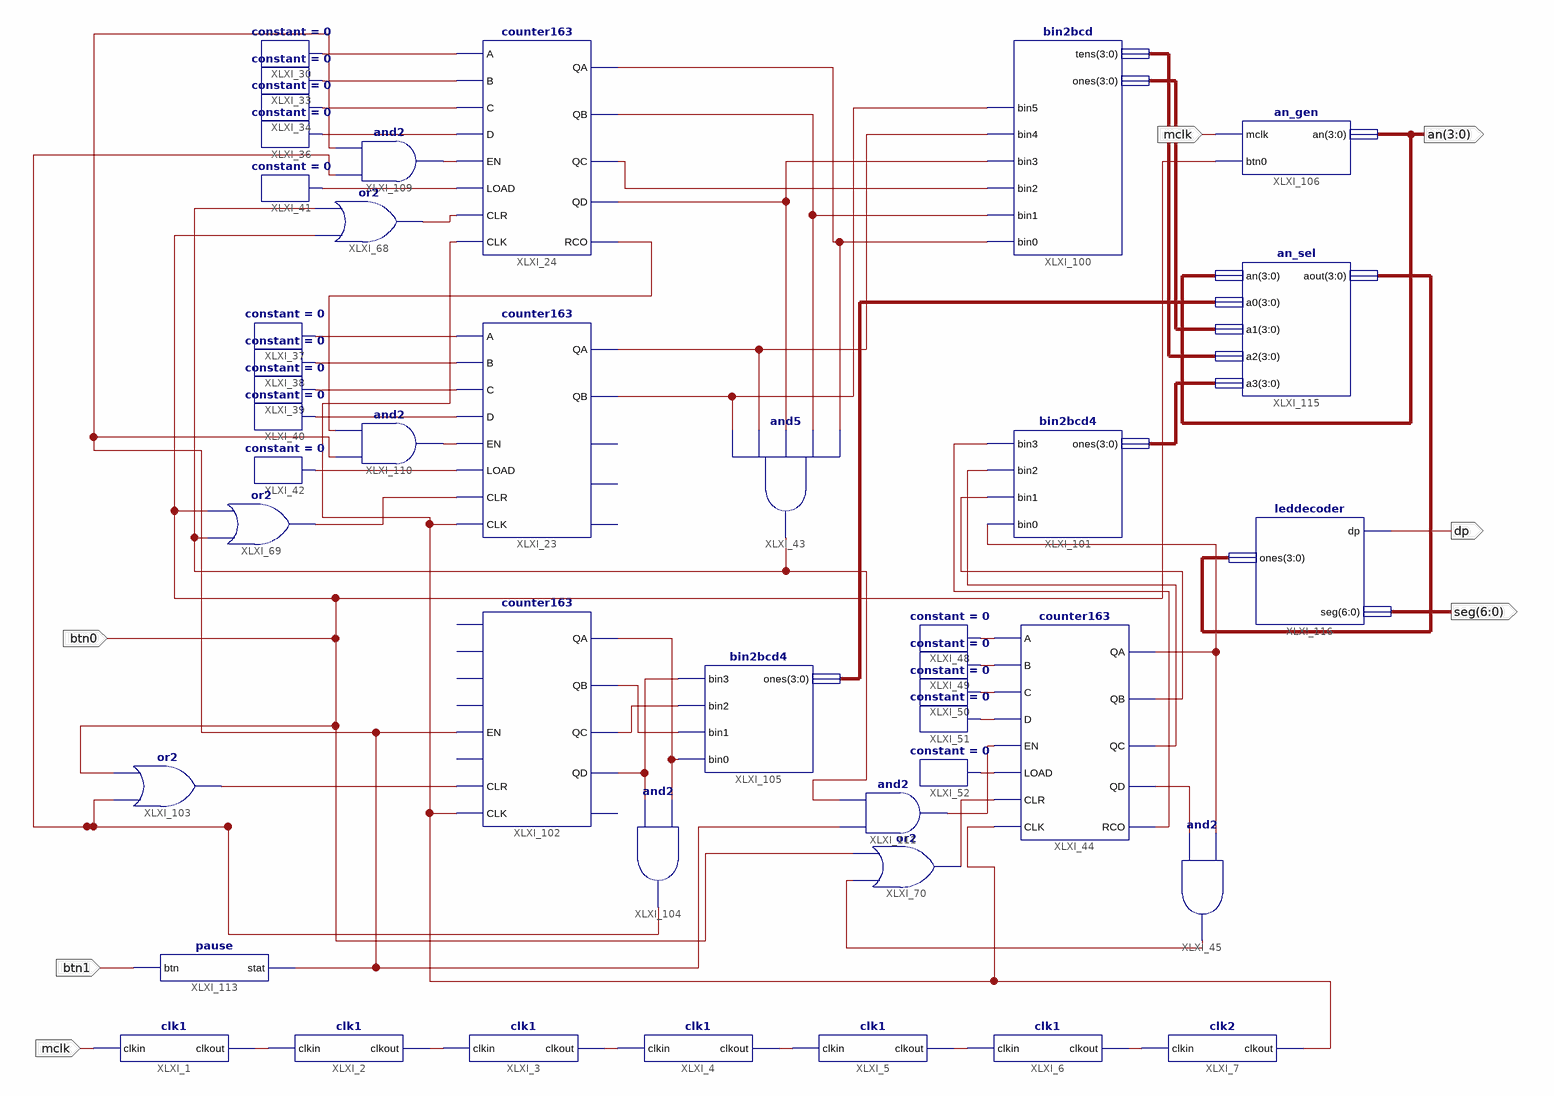
[diagram p0: schematic sheet 1]
// Xilinx ISE schematic sclk.sch (spartan3e) as structural Verilog: 43 symbols, 6 ports
module sclk (
  input  btn0,
  input  btn1,
  input  mclk,
  output [3:0] an,
  output [6:0] seg,
  output dp
);

  wire a1, a2, a3, a4, a5, a6, XLXN_1, XLXN_2, XLXN_3, XLXN_4, XLXN_5, XLXN_6, XLXN_38, XLXN_39, XLXN_40,
       XLXN_41, XLXN_42, XLXN_43, XLXN_44, XLXN_45, XLXN_46, XLXN_47, XLXN_51, XLXN_55, XLXN_56, XLXN_57,
       XLXN_58, XLXN_60, XLXN_66, XLXN_69, XLXN_106, XLXN_115, XLXN_117, XLXN_118, XLXN_119, XLXN_120,
       XLXN_151, XLXN_153, XLXN_158, XLXN_159, XLXN_160, XLXN_176, XLXN_177, XLXN_178, XLXN_179, XLXN_181,
       XLXN_184, XLXN_203, XLXN_206;
  wire [3:0] XLXN_188, XLXN_189, XLXN_190, XLXN_191, XLXN_192;

  clk2 XLXI_7 (.clkin(XLXN_6), .clkout(XLXN_203));
  clk1 XLXI_6 (.clkin(XLXN_5), .clkout(XLXN_6));
  clk1 XLXI_5 (.clkin(XLXN_4), .clkout(XLXN_5));
  clk1 XLXI_4 (.clkin(XLXN_3), .clkout(XLXN_4));
  clk1 XLXI_3 (.clkin(XLXN_2), .clkout(XLXN_3));
  clk1 XLXI_2 (.clkin(XLXN_1), .clkout(XLXN_2));
  clk1 XLXI_1 (.clkin(mclk), .clkout(XLXN_1));
  counter163 XLXI_44 (
    .A(XLXN_55), .B(XLXN_56), .C(XLXN_57), .D(XLXN_58), .EN(XLXN_181), .LOAD(XLXN_60), .CLR(XLXN_69),
    .CLK(XLXN_203), .RCO(XLXN_120), .QA(XLXN_117), .QD(XLXN_51), .QB(XLXN_118), .QC(XLXN_119));
  and XLXI_45 (XLXN_115, XLXN_51, XLXN_117);
  constant #(.CValue("0")) XLXI_48 (.O(XLXN_55));
  constant #(.CValue("0")) XLXI_49 (.O(XLXN_56));
  constant #(.CValue("0")) XLXI_50 (.O(XLXN_57));
  constant #(.CValue("0")) XLXI_51 (.O(XLXN_58));
  constant #(.CValue("0")) XLXI_52 (.O(XLXN_60));
  or XLXI_70 (XLXN_69, XLXN_115, btn0);
  bin2bcd XLXI_100 (.tens(XLXN_190), .ones(XLXN_189), .bin5(a6), .bin4(a5), .bin3(a4), .bin2(a3), .bin1(a2), .bin0(a1));
  bin2bcd4 XLXI_101 (.bin3(XLXN_120), .bin2(XLXN_119), .bin1(XLXN_118), .bin0(XLXN_117), .ones(XLXN_191));
  or XLXI_69 (XLXN_106, XLXN_184, btn0);
  or XLXI_68 (XLXN_66, btn0, XLXN_184);
  counter163 XLXI_24 (
    .A(XLXN_38), .B(XLXN_39), .C(XLXN_40), .D(XLXN_41), .EN(XLXN_177), .LOAD(XLXN_46), .CLR(XLXN_66),
    .CLK(XLXN_203), .RCO(XLXN_179), .QA(a1), .QD(a4), .QB(a2), .QC(a3));
  and XLXI_43 (XLXN_184, a6, a5, a4, a2, a1);
  counter163 XLXI_23 (
    .A(XLXN_42), .B(XLXN_43), .C(XLXN_44), .D(XLXN_45), .EN(XLXN_178), .LOAD(XLXN_47), .CLR(XLXN_106),
    .CLK(XLXN_203), .QA(a5), .QB(a6));  // open: RCO, QD, QC
  constant #(.CValue("0")) XLXI_41 (.O(XLXN_46));
  constant #(.CValue("0")) XLXI_36 (.O(XLXN_41));
  constant #(.CValue("0")) XLXI_34 (.O(XLXN_40));
  constant #(.CValue("0")) XLXI_33 (.O(XLXN_39));
  constant #(.CValue("0")) XLXI_30 (.O(XLXN_38));
  constant #(.CValue("0")) XLXI_38 (.O(XLXN_43));
  constant #(.CValue("0")) XLXI_37 (.O(XLXN_42));
  constant #(.CValue("0")) XLXI_39 (.O(XLXN_44));
  constant #(.CValue("0")) XLXI_40 (.O(XLXN_45));
  constant #(.CValue("0")) XLXI_42 (.O(XLXN_47));
  counter163 XLXI_102 (
    .EN(XLXN_206), .CLR(XLXN_151), .CLK(XLXN_203), .QA(XLXN_153), .QD(XLXN_158), .QB(XLXN_159), .QC(XLXN_160));  // open: A, B, C, D, LOAD, RCO
  or XLXI_103 (XLXN_151, XLXN_176, btn0);
  and XLXI_104 (XLXN_176, XLXN_158, XLXN_153);
  bin2bcd4 XLXI_105 (.bin3(XLXN_158), .bin2(XLXN_160), .bin1(XLXN_159), .bin0(XLXN_153), .ones(XLXN_188));
  an_gen XLXI_106 (.mclk(mclk), .btn0(btn0), .an(an));
  and XLXI_109 (XLXN_177, XLXN_176, XLXN_206);
  and XLXI_110 (XLXN_178, XLXN_206, XLXN_179);
  and XLXI_111 (XLXN_181, XLXN_206, XLXN_184);
  pause XLXI_113 (.btn(btn1), .stat(XLXN_206));
  an_sel XLXI_115 (.an(an), .a0(XLXN_188), .a1(XLXN_189), .a2(XLXN_190), .a3(XLXN_191), .aout(XLXN_192));
  leddecoder XLXI_116 (.ones(XLXN_192), .dp(dp), .seg(seg));
endmodule
